# EAGLE design cpu_board (EAGLE 7.7.0)
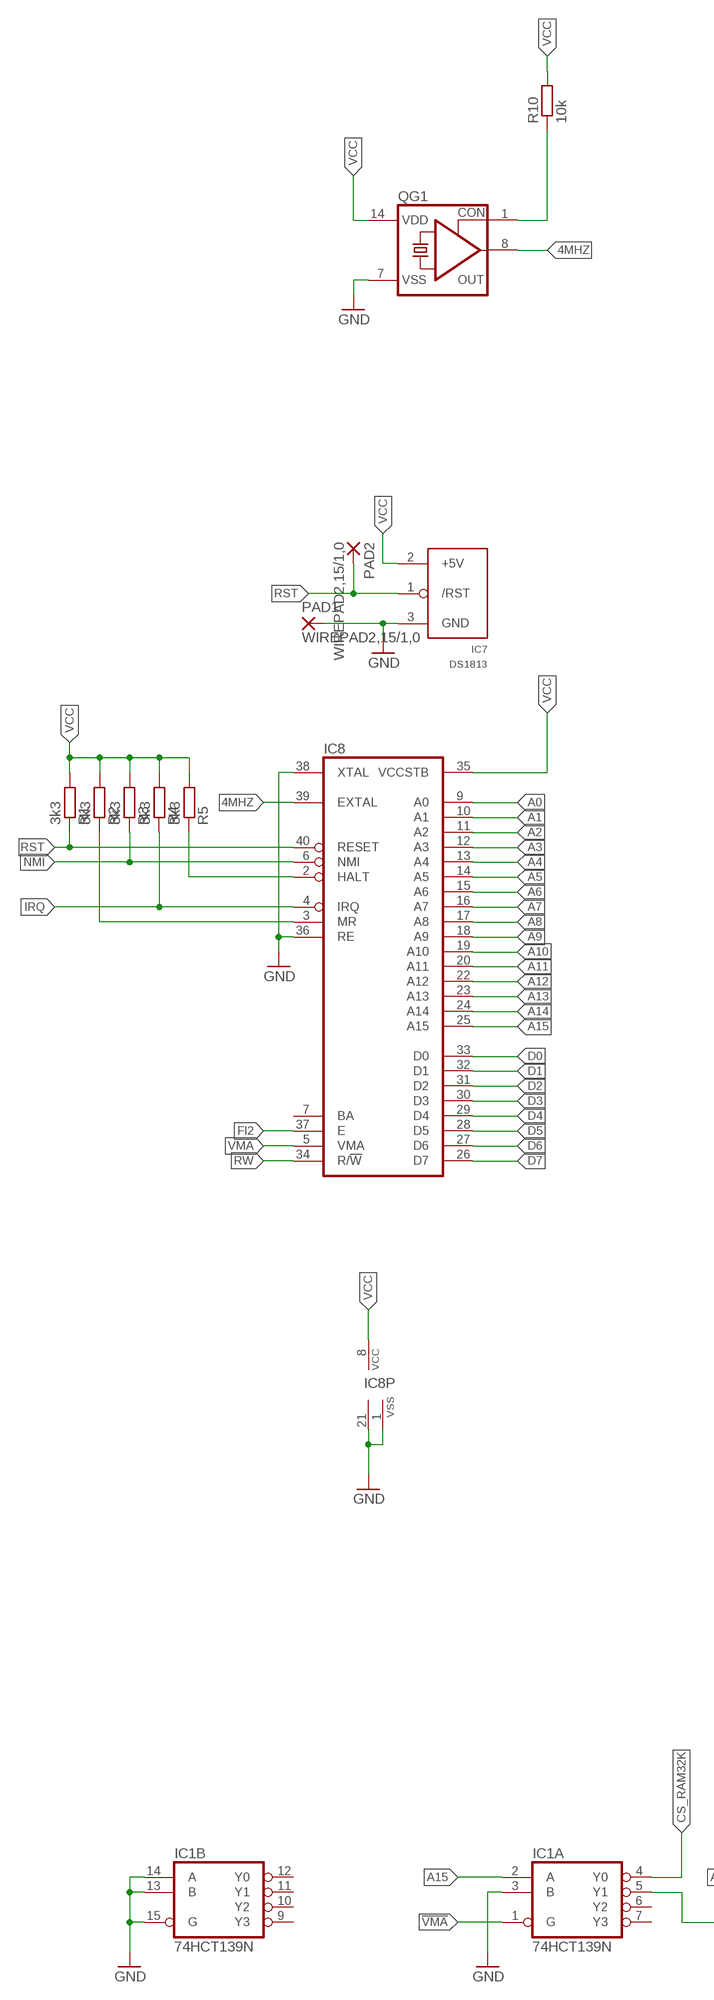
[diagram p0: schematic, sheet 1, part 1 of 2]
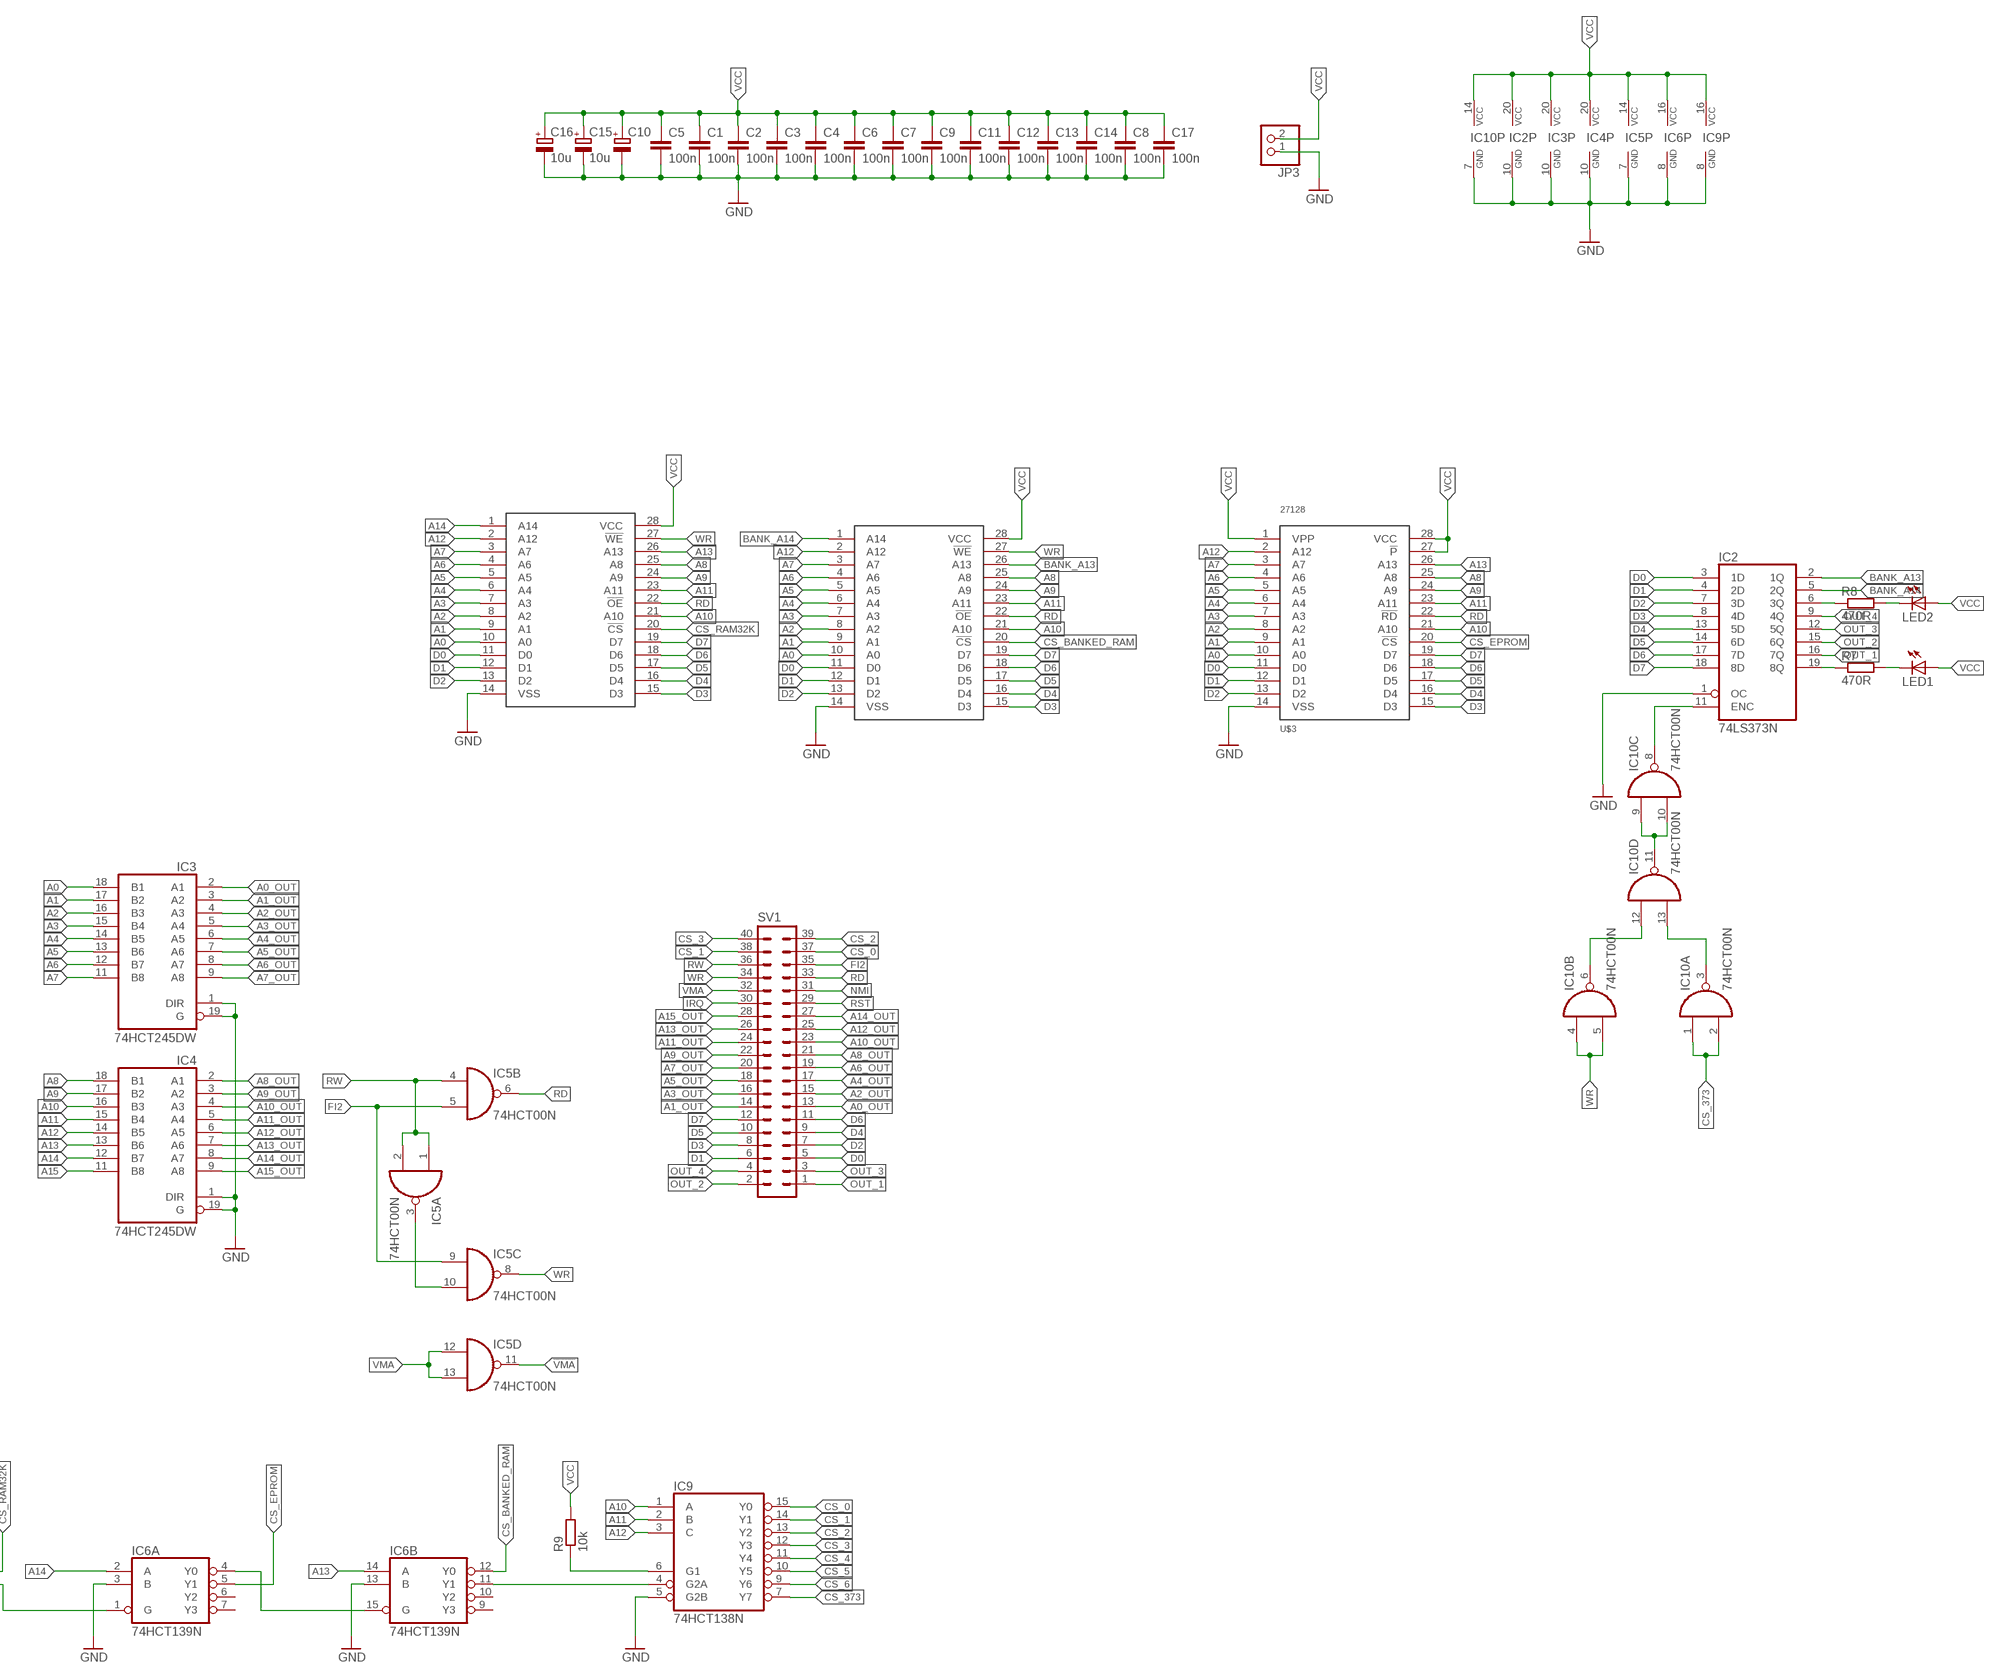
[diagram p1: schematic, sheet 1, part 2 of 2]

## Parts
C1  100n  C-EUC1206  [C1206]
C2  100n  C-EUC1206  [C1206]
C3  100n  C-EUC1206  [C1206]
C4  100n  C-EUC1206  [C1206]
C5  100n  C-EUC0603  [C0603]
C6  100n  C-EUC1206  [C1206]
C7  100n  C-EUC0603  [C0603]
C8  100n  C-EUC1206  [C1206]
C9  100n  C-EUC1206  [C1206]
C10  CPOL-EUE5-10.5  [E5-10,5]
C11  100n  C-EUC0805  [C0805]
C12  100n  C-EUC0805  [C0805]
C13  100n  C-EUC0805  [C0805]
C14  100n  C-EUC0603  [C0603]
C15  10u  CPOL-EUSMCB  [SMC_B]
C16  10u  CPOL-EUSMCB  [SMC_B]
C17  100n  C-EUC0805  [C0805]
IC1  74HCT139N  [DIL16]
IC2  74LS373N  [DIL20]
IC3  74HCT245DW  [SO20W]
IC4  74HCT245DW  [SO20W]
IC5  74HCT00N  [DIL14]
IC6  74HCT139N  [DIL16]
IC7  DS1813  [TO-92]
IC8  6802  [DIL40]
IC9  74HCT138N  [DIL16]
IC10  74HCT00N  [DIL14]
JP3  PINHD-1X2/90  [1X02/90]
LED1  LED5MM  [LED5MM]
LED2  LED5MM  [LED5MM]
PAD1  WIREPAD2,15/1,0  [2,15/1,0]
PAD2  WIREPAD2,15/1,0  [2,15/1,0]
QG1  CRYSTAL_RES-SG51  [SG51]
R1  3k3  R-EU_R1206  [R1206]
R2  3k3  R-EU_R1206  [R1206]
R3  3k3  R-EU_R1206  [R1206]
R4  3k3  R-EU_R0603  [R0603]
R5  3k3  R-EU_R1206  [R1206]
R7  470R  R-EU_R1206  [R1206]
R8  470R  R-EU_R1206  [R1206]
R9  10k  R-EU_0204/7  [0204/7]
R10  10k  R-EU_R1206  [R1206]
SV1  ML40L  [ML40L]
U$2  62256  [DIL28-6]
U$3  27128  [DIL28]
U$4  62256  [DIL28-6]

## Nets
4MHZ: IC8.39(EXTAL) QG1.8(OUT)
!VMA: IC1.1(A:G) IC5.11(D:O)
A0: IC3.18(B1) IC8.9(A0) U$2.10(A0) U$3.10(A0) U$4.10(A0)
A0_OUT: IC3.2(A1) SV1.13
A1: IC3.17(B2) IC8.10(A1) U$2.9(A1) U$3.9(A1) U$4.9(A1)
A1_OUT: IC3.3(A2) SV1.14
A2: IC3.16(B3) IC8.11(A2) U$2.8(A2) U$3.8(A2) U$4.8(A2)
A2_OUT: IC3.4(A3) SV1.15
A3: IC3.15(B4) IC8.12(A3) U$2.7(A3) U$3.7(A3) U$4.7(A3)
A3_OUT: IC3.5(A4) SV1.16
A4: IC3.14(B5) IC8.13(A4) U$2.6(A4) U$3.6(A4) U$4.6(A4)
A4_OUT: IC3.6(A5) SV1.17
A5: IC3.13(B6) IC8.14(A5) U$2.5(A5) U$3.5(A5) U$4.5(A5)
A5_OUT: IC3.7(A6) SV1.18
A6: IC3.12(B7) IC8.15(A6) U$2.4(A6) U$3.4(A6) U$4.4(A6)
A6_OUT: IC3.8(A7) SV1.19
A7: IC3.11(B8) IC8.16(A7) U$2.3(A7) U$3.3(A7) U$4.3(A7)
A7_OUT: IC3.9(A8) SV1.20
A8: IC4.18(B1) IC8.17(A8) U$2.25(A8) U$3.25(A8) U$4.25(A8)
A8_OUT: IC4.2(A1) SV1.21
A9: IC4.17(B2) IC8.18(A9) U$2.24(A9) U$3.24(A9) U$4.24(A9)
A9_OUT: IC4.3(A2) SV1.22
A10: IC4.16(B3) IC8.19(A10) IC9.1(A) U$2.21(A10) U$3.21(A10) U$4.21(A10)
A10_OUT: IC4.4(A3) SV1.23
A11: IC4.15(B4) IC8.20(A11) IC9.2(B) U$2.23(A11) U$3.23(A11) U$4.23(A11)
A11_OUT: IC4.5(A4) SV1.24
A12: IC4.14(B5) IC8.22(A12) IC9.3(C) U$2.2(A12) U$3.2(A12) U$4.2(A12)
A12_OUT: IC4.6(A5) SV1.25
A13: IC4.13(B6) IC6.14(B:A) IC8.23(A13) U$3.26(A13) U$4.26(A13)
A13_OUT: IC4.7(A6) SV1.26
A14: IC4.12(B7) IC6.2(A:A) IC8.24(A14) U$4.1(A14)
A14_OUT: IC4.8(A7) SV1.27
A15: IC1.2(A:A) IC4.11(B8) IC8.25(A15)
A15_OUT: IC4.9(A8) SV1.28
BANK_A13: IC2.2(1Q) U$2.26(A13)
BANK_A14: IC2.5(2Q) U$2.1(A14)
CS_0: IC9.15(Y0) SV1.37
CS_1: IC9.14(Y1) SV1.38
CS_2: IC9.13(Y2) SV1.39
CS_3: IC9.12(Y3) SV1.40
CS_4: IC9.11(Y4)
CS_5: IC9.10(Y5)
CS_6: IC9.9(Y6)
CS_373: IC9.7(Y7) IC10.1(A:I0) IC10.2(A:I1)
CS_BANKED_RAM: IC6.12(B:Y0) U$2.20(!CS)
CS_EPROM: IC6.5(A:Y1) U$3.20(!CS)
CS_RAM32K: IC1.4(A:Y0) U$4.20(!CS)
D0: IC2.3(1D) IC8.33(D0) SV1.5 U$2.11(D0) U$3.11(D0) U$4.11(D0)
D1: IC2.4(2D) IC8.32(D1) SV1.6 U$2.12(D1) U$3.12(D1) U$4.12(D1)
D2: IC2.7(3D) IC8.31(D2) SV1.7 U$2.13(D2) U$3.13(D2) U$4.13(D2)
D3: IC2.8(4D) IC8.30(D3) SV1.8 U$2.15(D3) U$3.15(D3) U$4.15(D3)
D4: IC2.13(5D) IC8.29(D4) SV1.9 U$2.16(D4) U$3.16(D4) U$4.16(D4)
D5: IC2.14(6D) IC8.28(D5) SV1.10 U$2.17(D5) U$3.17(D5) U$4.17(D5)
D6: IC2.17(7D) IC8.27(D6) SV1.11 U$2.18(D6) U$3.18(D6) U$4.18(D6)
D7: IC2.18(8D) IC8.26(D7) SV1.12 U$2.19(D7) U$3.19(D7) U$4.19(D7)
FI2: IC5.5(B:I1) IC5.9(C:I0) IC8.37(E) SV1.35
GND: C1.2 C2.2 C3.2 C4.2 C5.2 C6.2 C7.2 C8.2 C9.2 C10.- C11.2 C12.2 C13.2 C14.2 C15.- C16.- C17.2 IC1.3(A:B) IC1.13(B:B) IC1.14(B:A) IC1.15(B:G) IC2.1(OC) IC2.10(GND) IC3.1(DIR) IC3.10(GND) IC3.19(G) IC4.1(DIR) IC4.10(GND) IC4.19(G) IC5.7(P:GND) IC6.3(A:B) IC6.8(P:GND) IC6.13(B:B) IC7.3(GND) IC8.1(VSS) IC8.21(VSS) IC8.36(RE) IC8.38(XTAL) IC9.5(G2B) IC9.8(GND) IC10.7(P:GND) JP3.1 PAD1.1(P) QG1.7(VSS) U$2.14(VSS) U$3.14(VSS) U$4.14(VSS)
IRQ: IC8.4(IRQ) R4.1 SV1.30
N$1: IC1.5(A:Y1) IC6.1(A:G)
N$3: IC2.19(8Q) R7.1
N$4: LED1.K(C) R7.2
N$5: IC8.3(MR) R2.1
N$6: IC8.2(HALT) R5.1
N$7: QG1.1(CON) R10.1
N$11: IC2.11(ENC) IC10.8(C:O)
N$12: IC10.9(C:I0) IC10.10(C:I1) IC10.11(D:O)
N$13: IC10.3(A:O) IC10.13(D:I1)
N$14: IC10.6(B:O) IC10.12(D:I0)
N$15: IC2.6(3Q) R8.1
N$17: LED2.K(C) R8.2
N$18: IC5.3(A:O) IC5.10(C:I1)
N$19: IC6.4(A:Y0) IC6.15(B:G)
N$20: IC9.6(G1) R9.1
N$21: IC6.11(B:Y1) IC9.4(G2A)
NMI: IC8.6(NMI) R3.1 SV1.31
OUT_1: IC2.16(7Q) SV1.1
OUT_2: IC2.15(6Q) SV1.2
OUT_3: IC2.12(5Q) SV1.3
OUT_4: IC2.9(4Q) SV1.4
RD: IC5.6(B:O) SV1.33 U$2.22(!OE) U$3.22(!RD) U$4.22(!OE)
RST: IC7.1(/RST) IC8.40(RESET) PAD2.1(P) R1.1 SV1.29
RW: IC5.1(A:I0) IC5.2(A:I1) IC5.4(B:I0) IC8.34(R/!W) SV1.36
VCC: C1.1 C2.1 C3.1 C4.1 C5.1 C6.1 C7.1 C8.1 C9.1 C10.+ C11.1 C12.1 C13.1 C14.1 C15.+ C16.+ C17.1 IC2.20(VCC) IC3.20(VCC) IC4.20(VCC) IC5.14(P:VCC) IC6.16(P:VCC) IC7.2(+5V) IC8.8(VCC) IC8.35(VCCSTB) IC9.16(VCC) IC10.14(P:VCC) JP3.2 LED1.A LED2.A QG1.14(VDD) R1.2 R2.2 R3.2 R4.2 R5.2 R9.2 R10.2 U$2.28(VCC) U$3.1(VPP) U$3.27(!P) U$3.28(VCC) U$4.28(VCC)
VMA: IC5.12(D:I0) IC5.13(D:I1) IC8.5(VMA) SV1.32
WR: IC5.8(C:O) IC10.4(B:I0) IC10.5(B:I1) SV1.34 U$2.27(!WE) U$4.27(!WE)
Unconnected: IC1.6(A:Y2) IC1.7(A:Y3) IC1.9(B:Y3) IC1.10(B:Y2) IC1.11(B:Y1) IC1.12(B:Y0) IC6.6(A:Y2) IC6.7(A:Y3) IC6.9(B:Y3) IC6.10(B:Y2) IC8.7(BA)

## Power pins joined to a net without a drawn wire
GND: IC1.8(P:GND)
VCC: IC1.16(P:VCC)

## Library data of the parts
C1-C9 C11-C14 C17 = rcl:C-EU: CAPACITOR, European symbol
C10 C15 C16 = rcl:CPOL-EU: POLARIZED CAPACITOR, European symbol
IC1 IC6 = 74xx-eu:74*139: Dual 2-line to 4-line DECODER/DEMULTIPLEXER
IC2 = 74xx-eu:74*373: Octal D type transparent LATCH, edge triggered
IC3 IC4 = 74xx-eu:74*245: Octal BUS TRANSCEIVER, 3-state
IC5 IC10 = 74xx-eu:74*00: Quad 2-input NAND gate
IC7 = ds1813_revised:DS1813
IC8 = micro-motorola:6802: MICROCONTROLLER/MEMORY DEVICE; OC_FARNELL: unknown; OC_NEWARK: unknown
IC9 = 74xx-eu:74*138: 3-line to 8-line DECODER/DEMULTIPLEXER
JP3 = pinhead:PINHD-1X2: PIN HEADER
LED1 LED2 = led:LED: LED OSRAM: - CHIPLED LG R971, LG N971, LY N971, LG Q971, LY Q971, LO R971, LY R971 LH N974, LH R974 LS Q976, LO Q976, LY Q976 LO Q996 - Hyper CHIPLED LW Q18S LB Q993, LB Q99A, LB R99A - SideLED LS A670, LO A670, LY A670, LG A670, LP A670 LB A673, LV A673, LT A673, LW A673 LH A674 LY A675 LS A676, LA A676, LO A676, LY A676, LW A676 LS A679, LY A679, LG A679 - Hyper Micro SIDELED® LS Y876, LA Y876, LO Y876, LY Y876 LT Y87S - SmartLED LW L88C, LW L88S LB L89C, LB L89S, LG L890 LS L89K, LO L89K, LY L89K LS L896, LA L896, LO L896, LY L896 - TOPLED LS T670, LO T670, LY T670, LG T670, LP T670 LSG T670, LSP T670, LSY T670, LOP T670, LYG T670 LG T671, LOG T671, LSG T671 LB T673, LV T673, LT T673, LW T673 LH T674 LS T676, LA T676, LO T676, LY T676, LB T676, LH T676, LSB T676, LW T676 LB T67C, LV T67C, LT T67C, LS T67K, LO T67K, LY T67K, LW E67C LS E67B, LA E67B, LO E67B, LY E67B, LB E67C, LV E67C, LT E67C LW T67C LS T679, LY T679, LG T679 LS T770, LO T770, LY T770, LG T770, LP T770 LB T773, LV T773, LT T773, LW T773 LH T774 LS E675, LA E675, LY E675, LS T675 LS T776, LA T776, LO T776, LY T776, LB T776 LHGB T686 LT T68C, LB T68C - Hyper Mini TOPLED® LB M676 - Mini TOPLED Santana® LG M470 LS M47K, LO M47K, LY M47K Source: http://www.osram.convergy.de LUXEON: - LUMILED® LXK2-PW12-R00, LXK2-PW12-S00, LXK2-PW14-U00, LXK2-PW14-V00 LXK2-PM12-R00, LXK2-PM12-S00, LXK2-PM14-U00 LXK2-PE12-Q00, LXK2-PE12-R00, LXK2-PE12-S00, LXK2-PE14-T00, LXK2-PE14-U00 LXK2-PB12-K00, LXK2-PB12-L00, LXK2-PB12-M00, LXK2-PB14-N00, LXK2-PB14-P00, LXK2-PB14-Q00 LXK2-PR12-L00, LXK2-PR12-M00, LXK2-PR14-Q00, LXK2-PR14-R00 LXK2-PD12-Q00, LXK2-PD12-R00, LXK2-PD12-S00 LXK2-PH12-R00, LXK2-PH12-S00 LXK2-PL12-P00, LXK2-PL12-Q00, LXK2-PL12-R00 Source: www.luxeon.com KINGBRIGHT: KA-3528ASYC Source: www.kingbright.com
PAD1 PAD2 = wirepad:WIREPAD: Wire PAD connect wire on PCB
QG1 = crystal:CRYSTAL_RES-: CRYSTAL RESONATOR; OC_FARNELL: unknown; OC_NEWARK: unknown
R1-R5 R7-R10 = rcl:R-EU_: RESISTOR, European symbol
SV1 = con-harting-ml:ML40: HARTING; OC_FARNELL: unknown; OC_NEWARK: unknown
U$2 U$4 = memory-sram:62256
U$3 = mw:27128

## Board
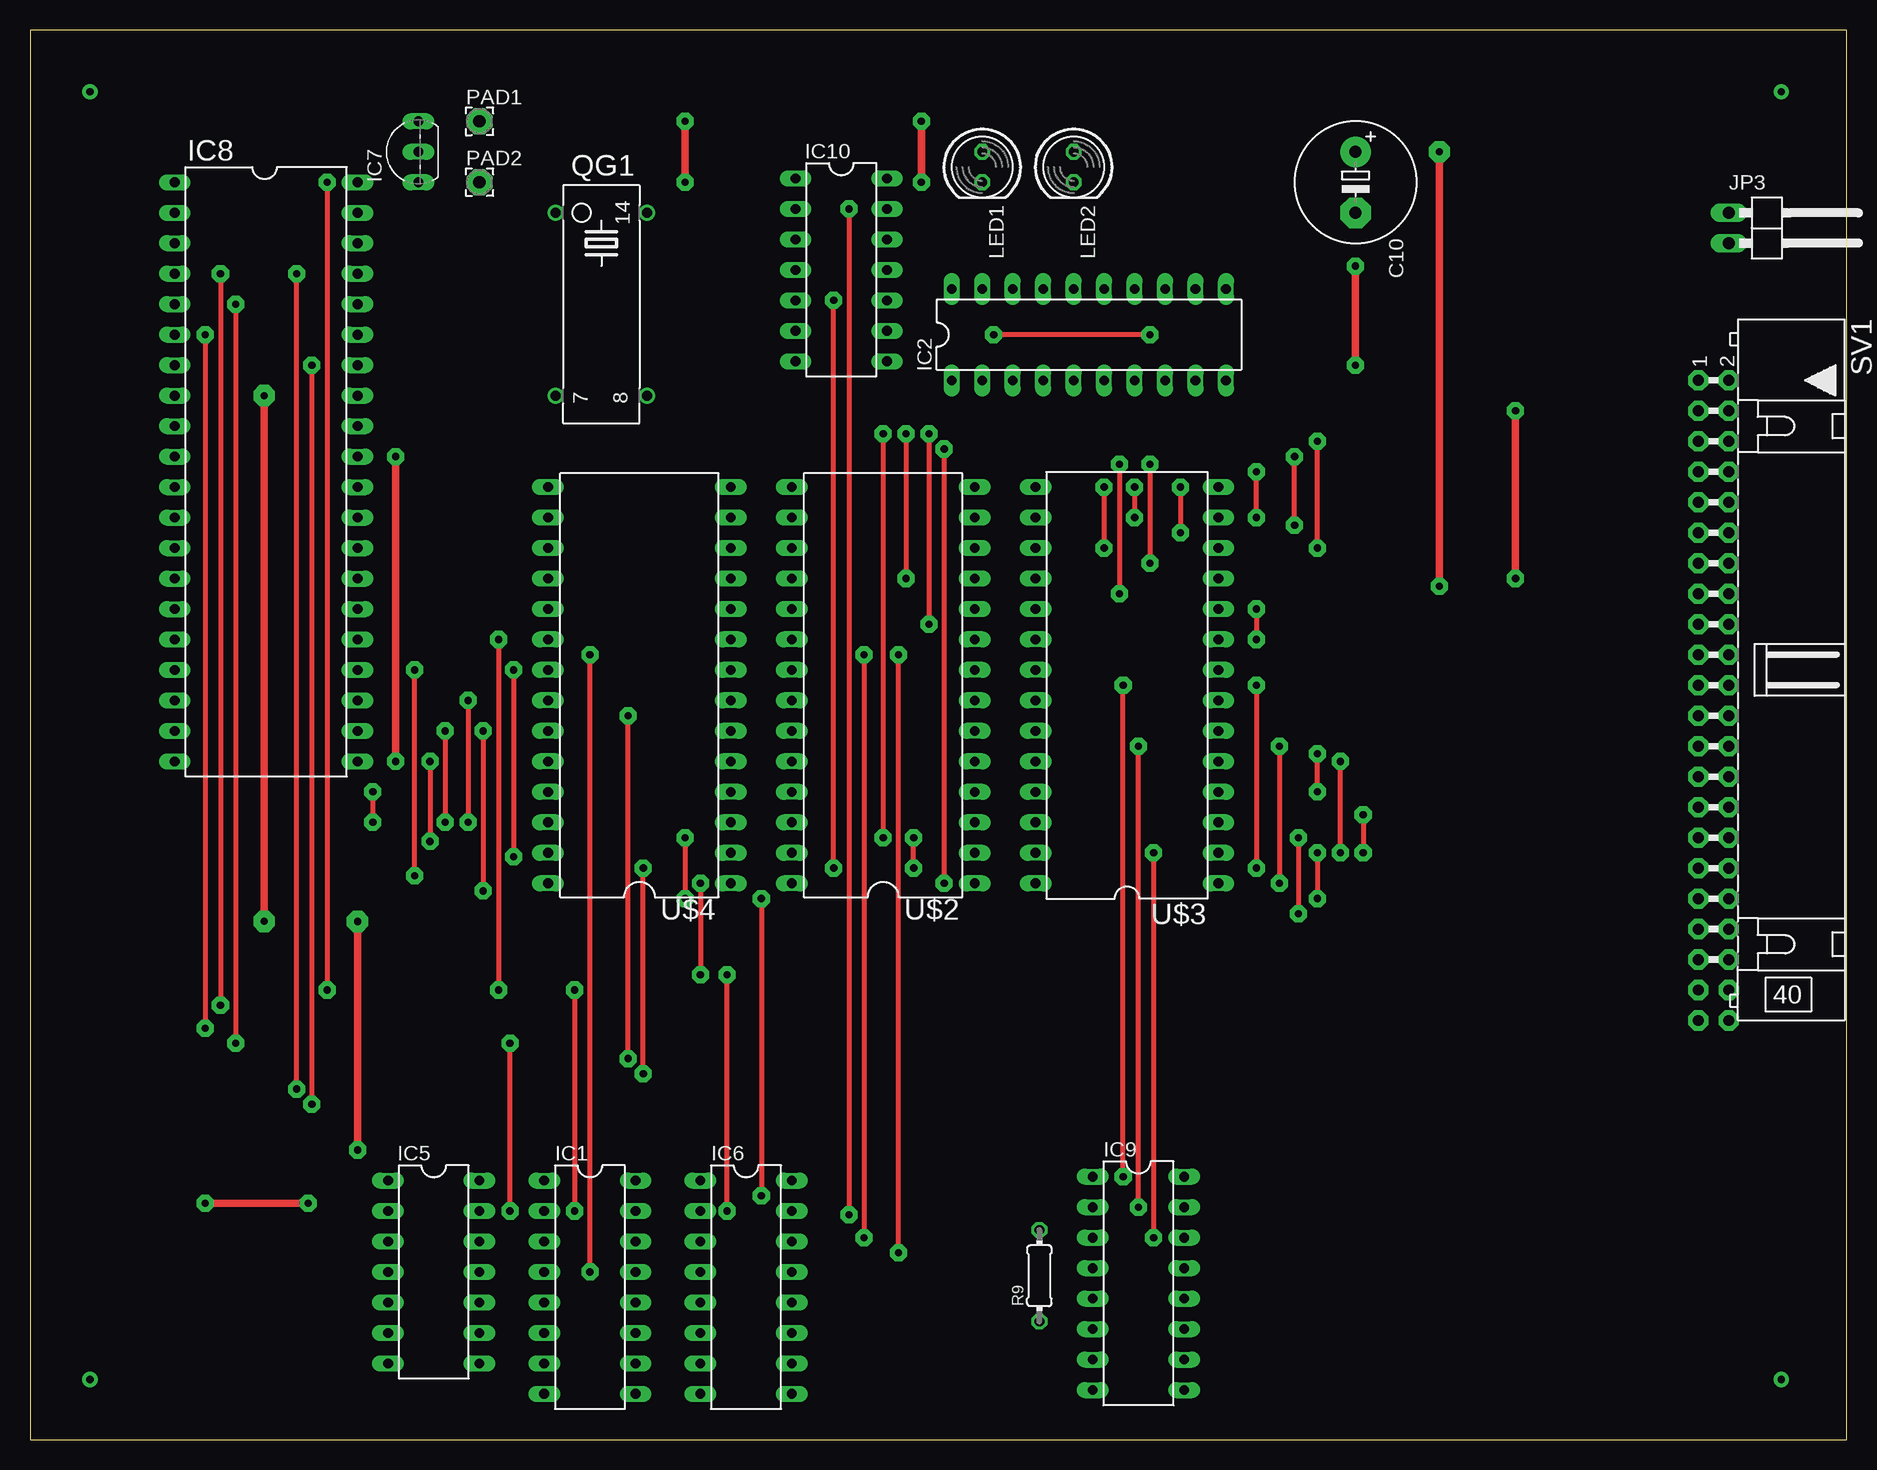
[diagram p2: board, top side]
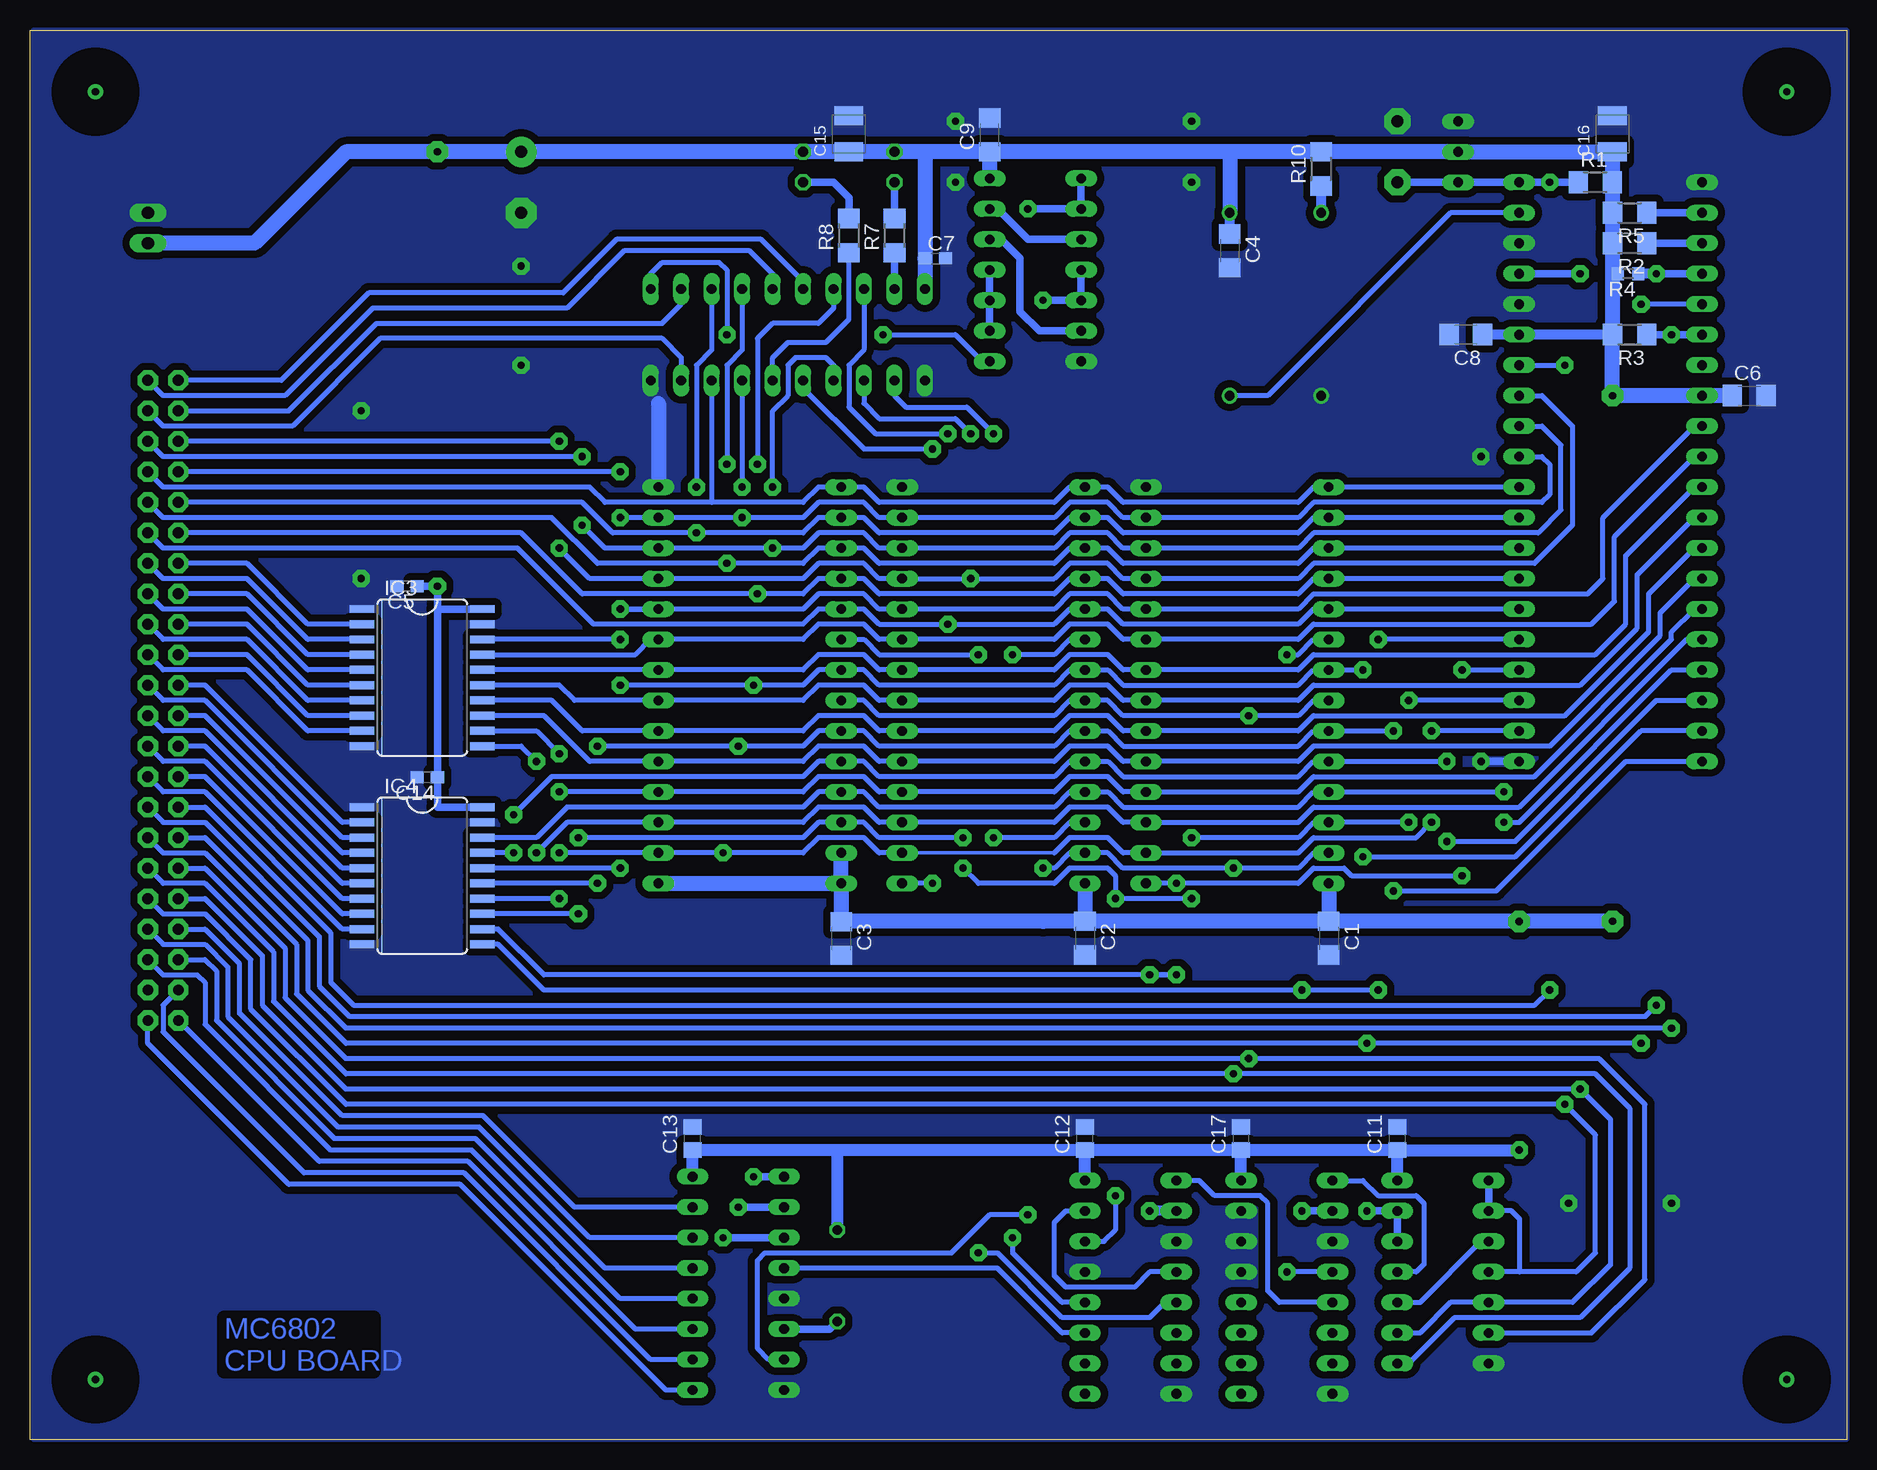
[diagram p3: board, bottom side, seen from below]

Size 151.44 x 117.47 mm. Coordinates in mm from the lower left corner, seen from the top.
Outline: 0,0 151.44,0 151.44,117.47 0,117.47 0,0
Copper layers (1*16): Top 0.035mm / dielectric 1.5mm / Bottom 0.035mm
Design rules "default *": minimum track width 10mil, minimum drill 24mil, track to track 8mil, track to pad 8mil, pad to pad 8mil, via to via 8mil, smd to smd 8mil, copper to edge 0mil, drill to drill 8mil, minimum pad ring 10mil, minimum via ring 8mil, stop-mask expansion 4mil, vias tented up to drill 0mil, thermal gap 10mil
bRestrict: area 2,2 to 8,8; area 2,109.3 to 8,115.4; area 142.9,2 to 149,8; area 142.9,109.3 to 149,115.4

### Footprints (pad centres in the part's own frame; a part is rotated, then mirrored left to right if it is on the bottom)
C1206 = smd 1.6 x 1.8: 1 -1.4,0; 2 1.4,0
C0603 = smd 1.1 x 1: 1 -0.85,0; 2 0.85,0
E5-10,5 = drill 1.016 pad 2.54: + -2.54,0 | drill 1.016 pad 2.54 octagon: - 2.54,0
C0805 = smd 1.3 x 1.5: 1 -0.95,0; 2 0.95,0
SMC_B = smd 1.6 x 2.4: + -1.5,0; - 1.5,0
DIL16 = drill 0.813 long: 1 -8.89,-3.81; 2 -6.35,-3.81; 3 -3.81,-3.81; 4 -1.27,-3.81; 5 1.27,-3.81; 6 3.81,-3.81; 7 6.35,-3.81; 8 8.89,-3.81; 9 8.89,3.81; 10 6.35,3.81; 11 3.81,3.81; 12 1.27,3.81; 13 -1.27,3.81; 14 -3.81,3.81; 15 -6.35,3.81; 16 -8.89,3.81
DIL20 = drill 0.813 long: 1 -11.43,-3.81; 2 -8.89,-3.81; 3 -6.35,-3.81; 4 -3.81,-3.81; 5 -1.27,-3.81; 6 1.27,-3.81; 7 3.81,-3.81; 8 6.35,-3.81; 9 8.89,-3.81; 10 11.43,-3.81; 11 11.43,3.81; 12 8.89,3.81; 13 6.35,3.81; 14 3.81,3.81; 15 1.27,3.81; 16 -1.27,3.81; 17 -3.81,3.81; 18 -6.35,3.81; 19 -8.89,3.81; 20 -11.43,3.81
SO20W = smd 0.66 x 2.032: 1 -5.715,-5.029; 2 -4.445,-5.029; 3 -3.175,-5.029; 4 -1.905,-5.029; 5 -0.635,-5.029; 6 0.635,-5.029; 7 1.905,-5.029; 8 3.175,-5.029; 9 4.445,-5.029; 10 5.715,-5.029; 11 5.715,5.029; 12 4.445,5.029; 13 3.175,5.029; 14 1.905,5.029; 15 0.635,5.029; 16 -0.635,5.029; 17 -1.905,5.029; 18 -3.175,5.029; 19 -4.445,5.029; 20 -5.715,5.029
DIL14 = drill 0.813 long: 1 -7.62,-3.81; 2 -5.08,-3.81; 3 -2.54,-3.81; 4 0,-3.81; 5 2.54,-3.81; 6 5.08,-3.81; 7 7.62,-3.81; 8 7.62,3.81; 9 5.08,3.81; 10 2.54,3.81; 11 0,3.81; 12 -2.54,3.81; 13 -5.08,3.81; 14 -7.62,3.81
TO-92 = drill 0.813 long: 1 -2.54,0; 2 0,0; 3 2.54,0
DIL40 = drill 0.813 long: 1 -24.13,-7.62; 2 -21.59,-7.62; 3 -19.05,-7.62; 4 -16.51,-7.62; 5 -13.97,-7.62; 6 -11.43,-7.62; 7 -8.89,-7.62; 8 -6.35,-7.62; 9 -3.81,-7.62; 10 -1.27,-7.62; 11 1.27,-7.62; 12 3.81,-7.62; 13 6.35,-7.62; 14 8.89,-7.62; 15 11.43,-7.62; 16 13.97,-7.62; 17 16.51,-7.62; 18 19.05,-7.62; 19 21.59,-7.62; 20 24.13,-7.62; 21 24.13,7.62; 22 21.59,7.62; 23 19.05,7.62; 24 16.51,7.62; 25 13.97,7.62; 26 11.43,7.62; 27 8.89,7.62; 28 6.35,7.62; 29 3.81,7.62; 30 1.27,7.62; 31 -1.27,7.62; 32 -3.81,7.62; 33 -6.35,7.62; 34 -8.89,7.62; 35 -11.43,7.62; 36 -13.97,7.62; 37 -16.51,7.62; 38 -19.05,7.62; 39 -21.59,7.62; 40 -24.13,7.62
1X02/90 = drill 1.016 long: 1 -1.27,-3.81; 2 1.27,-3.81
LED5MM = drill 0.813 octagon: A -1.27,0; K 1.27,0
2,15/1,0 = drill 1.016 pad 2.159 octagon: 1 0,0
SG51 = drill 0.813: 1 -7.62,-3.81; 7 7.62,-3.81; 8 7.62,3.81; 14 -7.62,3.81
R1206 = smd 1.6 x 1.803: 1 -1.422,0; 2 1.422,0
R0603 = smd 1 x 1.1: 1 -0.85,0; 2 0.85,0
0204/7 = drill 0.813 octagon: 1 -3.81,0; 2 3.81,0
ML40L = drill 0.914 pad 1.676 octagon: 1 -24.13,-1.27; 2 -24.13,1.27; 3 -21.59,-1.27; 4 -21.59,1.27; 5 -19.05,-1.27; 6 -19.05,1.27; 7 -16.51,-1.27; 8 -16.51,1.27; 9 -13.97,-1.27; 10 -13.97,1.27; 11 -11.43,-1.27; 12 -11.43,1.27; 13 -8.89,-1.27; 14 -8.89,1.27; 15 -6.35,-1.27; 16 -6.35,1.27; 17 -3.81,-1.27; 18 -3.81,1.27; 19 -1.27,-1.27; 20 -1.27,1.27; 21 1.27,-1.27; 22 1.27,1.27; 23 3.81,-1.27; 24 3.81,1.27; 25 6.35,-1.27; 26 6.35,1.27; 27 8.89,-1.27; 28 8.89,1.27; 29 11.43,-1.27; 30 11.43,1.27; 31 13.97,-1.27; 32 13.97,1.27; 33 16.51,-1.27; 34 16.51,1.27; 35 19.05,-1.27; 36 19.05,1.27; 37 21.59,-1.27; 38 21.59,1.27; 39 24.13,-1.27; 40 24.13,1.27
DIL28-6 = drill 0.813 long: 1 -16.51,-7.62; 2 -13.97,-7.62; 3 -11.43,-7.62; 4 -8.89,-7.62; 5 -6.35,-7.62; 6 -3.81,-7.62; 7 -1.27,-7.62; 8 1.27,-7.62; 9 3.81,-7.62; 10 6.35,-7.62; 11 8.89,-7.62; 12 11.43,-7.62; 13 13.97,-7.62; 14 16.51,-7.62; 15 16.51,7.62; 16 13.97,7.62; 17 11.43,7.62; 18 8.89,7.62; 19 6.35,7.62; 20 3.81,7.62; 21 1.27,7.62; 22 -1.27,7.62; 23 -3.81,7.62; 24 -6.35,7.62; 25 -8.89,7.62; 26 -11.43,7.62; 27 -13.97,7.62; 28 -16.51,7.62
DIL28 = drill 0.813 long: 1 -16.51,-7.62; 2 -13.97,-7.62; 3 -11.43,-7.62; 4 -8.89,-7.62; 5 -6.35,-7.62; 6 -3.81,-7.62; 7 -1.27,-7.62; 8 1.27,-7.62; 9 3.81,-7.62; 10 6.35,-7.62; 11 8.89,-7.62; 12 11.43,-7.62; 13 13.97,-7.62; 14 16.51,-7.62; 15 16.51,7.62; 16 13.97,7.62; 17 11.43,7.62; 18 8.89,7.62; 19 6.35,7.62; 20 3.81,7.62; 21 1.27,7.62; 22 -1.27,7.62; 23 -3.81,7.62; 24 -6.35,7.62; 25 -8.89,7.62; 26 -11.43,7.62; 27 -13.97,7.62; 28 -16.51,7.62

### Placement (x,y rotation side)
C1  43.18,41.78 270 bottom
C2  63.5,41.78 270 bottom
C3  83.82,41.76 270 bottom
C4  51.44,99.06 270 bottom
C5  120,71.12 180 bottom
C6  8.13,87 0 bottom
C7  75.98,98.42 0 bottom
C8  31.75,92.08 180 bottom
C9  71.44,108.72 90 bottom
C10  110.49,104.78 270 top
C11  37.47,25.08 90 bottom
C12  63.5,25.08 90 bottom
C13  96.2,25.08 90 bottom
C14  118.33,55.18 180 bottom
C15  83.19,108.81 90 bottom
C16  19.53,108.81 90 bottom
C17  50.48,25.08 90 bottom
IC1  46.67,12.7 270 top
IC2  88.27,92.08 0 top
IC3  118.75,63.5 270 bottom
IC4  118.75,46.99 270 bottom
IC5  33.66,13.97 270 top
IC6  59.69,12.7 270 top
IC7  32.38,107.31 90 top
IC8  19.68,80.64 270 top
IC9  92.39,13.02 270 top
IC10  67.63,97.47 270 top
JP3  145.41,100.97 270 top
LED1  79.38,106.05 270 top
LED2  87,106.05 270 top
PAD1  37.47,109.86 0 top
PAD2  37.47,104.78 0 top
QG1  47.62,94.61 270 top
R1  20.95,104.78 0 bottom
R2  18.1,99.69 180 bottom
R3  18.1,92.08 180 bottom
R4  18.22,97.16 180 bottom
R5  18.1,102.23 180 bottom
R7  79.38,100.33 90 bottom
R8  83.19,100.33 90 bottom
R9  84.14,13.65 90 top
R10  43.81,105.89 90 bottom
SV1  140.34,64.14 270 top
U$2  71.12,62.87 90 top
U$3  91.44,62.87 90 top
U$4  50.8,62.87 90 top

### Tracks (layer width: path | path; a pad name or v marks a point on that pad's centre or on a via)
4MHZ
  Bottom 0.406: IC8.39 33.02,102.23 48.26,87 QG1.8
!VMA
  Bottom 0.406: IC1.1 40.32,21.59 39.05,20.32 35.88,20.32 35.24,19.68 35.24,14.61 35.88,13.97 IC5.11
A0  (via drill 0.6 pad 1.42)
  Top 0.406: v102.23,69.22 v102.23,66.67
  Bottom 0.406: IC8.9 12.7,84.45 20.32,76.83 20.32,71.75 21.59,70.48 44.45,70.48 45.72,69.22 U$4.10 60.33,69.22 61.59,70.48 64.77,70.48 66.04,69.22 U$2.10 80.64,69.22 81.92,70.48 85.72,70.48 87,69.22 v102.23,69.22 U$3.10 | v102.23,66.67 IC3.18
A0_OUT
  Bottom 0.406: IC3.2 128.27,67.94 133.35,73.03 SV1.13
A1
  Bottom 0.406: IC8.10 12.7,81.92 19.37,75.25 19.37,69.85 21.27,67.94 44.45,67.94 45.72,66.67 U$4.9 60.33,66.67 61.59,67.94 64.77,67.94 66.04,66.67 U$2.9 80.64,66.67 81.92,67.94 85.72,67.94 87,66.67 U$3.9 99.69,66.67 100.97,65.41 IC3.17
A1_OUT
  Bottom 0.406: IC3.3 128.27,66.67 133.35,71.75 140.34,71.75 SV1.14
A2
  Bottom 0.406: IC8.11 12.7,79.38 18.41,73.66 18.41,67.94 20.95,65.41 44.45,65.41 45.72,64.14 U$4.8 60.33,64.14 61.59,65.41 64.77,65.41 66.04,64.14 U$2.8 80.64,64.14 81.92,65.41 85.72,65.41 87,64.14 U$3.8 IC3.16
A2_OUT
  Bottom 0.406: IC3.4 128.27,65.41 133.35,70.48 SV1.15
A3
  Bottom 0.406: IC8.12 12.7,76.83 17.46,72.07 17.46,67.63 22.23,62.87 44.45,62.87 45.72,61.59 U$4.7 60.33,61.59 61.59,62.87 64.77,62.87 66.04,61.59 U$2.7 80.64,61.59 81.92,62.87 85.72,62.87 87,61.59 U$3.7 106.05,61.59 107.31,62.87 IC3.15
A3_OUT
  Bottom 0.406: IC3.5 128.27,64.14 133.35,69.22 140.34,69.22 SV1.16
A4
  Bottom 0.406: IC8.13 12.7,74.3 16.51,70.48 16.51,67.31 23.5,60.33 44.45,60.33 45.72,59.05 U$4.6 60.33,59.05 61.59,60.33 64.77,60.33 66.04,59.05 U$2.6 80.64,59.05 81.92,60.33 85.72,60.33 87,59.05 U$3.6 105.41,59.05 107.95,61.59 IC3.14
A4_OUT
  Bottom 0.406: IC3.6 128.27,62.87 133.35,67.94 SV1.17
A5
  Bottom 0.406: IC8.14 12.7,71.75 15.56,68.9 15.56,66.99 24.77,57.78 44.45,57.78 45.72,56.52 U$4.5 60.33,56.52 61.59,57.78 64.77,57.78 66.04,56.52 U$2.5 80.64,56.52 81.92,57.78 85.72,57.78 87,56.52 U$3.5 104.78,56.52 108.58,60.33 IC3.13
A5_OUT
  Bottom 0.406: IC3.7 128.27,61.59 133.35,66.67 140.34,66.67 SV1.18
A6  (via drill 0.6 pad 1.42)
  Top 0.406: v107.31,53.98 v107.31,57.15
  Bottom 0.406: v107.31,53.98 U$3.4 87,53.98 85.72,55.24 81.92,55.24 80.64,53.98 U$2.4 66.04,53.98 64.77,55.24 61.59,55.24 60.33,53.98 U$4.4 45.72,53.98 44.45,55.24 26.04,55.24 14.61,66.67 14.61,67.31 12.7,69.22 IC8.15 | IC3.12 109.22,59.05 v107.31,57.15
A6_OUT
  Bottom 0.406: IC3.8 128.27,60.33 133.35,65.41 SV1.19
A7  (via drill 0.6 pad 1.42)
  Top 0.406: v109.22,48.9 v109.22,56.52
  Bottom 0.406: IC8.16 13.34,66.67 27.3,52.7 44.45,52.7 45.72,51.44 U$4.3 60.33,51.44 61.59,52.7 64.77,52.7 66.04,51.44 U$2.3 80.64,51.44 81.92,52.7 85.72,52.7 87,51.44 U$3.3 106.68,51.44 v109.22,48.9 | IC3.11 110.49,57.78 v109.22,56.52
A7_OUT
  Bottom 0.406: IC3.9 128.27,59.05 133.35,64.14 140.34,64.14 SV1.20
A8  (via drill 0.6 pad 1.42)
  Top 0.406: v28.57,53.98 v28.57,51.44
  Bottom 0.406: v28.57,53.98 U$4.25 44.45,53.98 45.72,52.7 60.33,52.7 61.59,53.98 U$2.25 64.77,53.98 66.04,52.7 80.64,52.7 81.92,53.98 U$3.25 85.72,53.98 87,52.7 106.68,52.7 109.22,50.16 IC4.18 | IC8.17 14.61,64.14 27.3,51.44 v28.57,51.44
A8_OUT
  Bottom 0.406: IC4.2 125.41,51.44 136.84,62.87 SV1.21
A9  (via drill 0.6 pad 1.42)
  Top 0.406: v33.34,56.52 v33.34,49.85 | v111.12,52.07 v111.12,48.9
  Bottom 0.406: v33.34,56.52 U$4.24 44.45,56.52 45.72,55.24 60.33,55.24 61.59,56.52 U$2.24 64.77,56.52 66.04,55.24 80.64,55.24 81.92,56.52 U$3.24 85.72,56.52 87,55.24 107.95,55.24 v111.12,52.07 | IC8.18 15.88,61.59 27.62,49.85 v33.34,49.85 | v111.12,48.9 IC4.17
A9_OUT
  Bottom 0.406: IC4.3 125.41,50.16 136.84,61.59 140.34,61.59 SV1.22
A10  (via drill 0.6 pad 1.42)
  Top 0.406: v40.32,64.14 v40.32,48.58 | v102.23,62.87 v102.23,47.62 | v91.12,21.91 v91.12,62.87
  Bottom 0.406: v40.32,64.14 U$4.21 44.45,64.14 45.72,62.87 60.33,62.87 61.59,64.14 U$2.21 64.77,64.14 66.04,62.87 80.64,62.87 81.92,64.14 U$3.21 85.72,64.14 87,62.87 v91.12,62.87 v102.23,62.87 | v40.32,48.58 27.62,48.58 17.14,59.05 IC8.19 | v102.23,47.62 IC4.16
  Bottom 0.61: IC9.1 v91.12,21.91
A10_OUT
  Bottom 0.406: IC4.4 125.41,48.9 136.84,60.33 SV1.23
A11  (via drill 0.6 pad 1.42)
  Top 0.406: v37.78,59.05 v37.78,45.72 | v104.14,57.78 v104.14,46.35 | v92.39,19.37 v92.39,57.78
  Bottom 0.406: v37.78,59.05 U$4.23 44.45,59.05 45.72,57.78 60.33,57.78 61.59,59.05 U$2.23 64.77,59.05 66.04,57.78 80.64,57.78 81.92,59.05 U$3.23 85.72,59.05 87,57.78 v92.39,57.78 v104.14,57.78 | v37.78,45.72 29.21,45.72 18.41,56.52 IC8.20 | v104.14,46.35 IC4.15
  Bottom 0.61: IC9.2 v92.39,19.37
A11_OUT
  Bottom 0.406: IC4.5 125.41,47.62 136.84,59.05 140.34,59.05 SV1.24
A12  (via drill 0.6 pad 1.42)
  Top 0.406: v34.61,59.05 v34.61,51.44 | v107.31,48.9 v107.31,45.09 | v93.66,48.9 v93.66,16.83
  Bottom 0.305: 66.04,48.9 U$2.2
  Bottom 0.406: U$2.2 80.64,48.9 81.92,50.16 85.72,50.16 87,48.9 v93.66,48.9 U$3.2 v107.31,48.9 | 66.04,48.9 64.77,50.16 61.59,50.16 60.33,48.9 U$4.2 45.72,48.9 44.45,50.16 35.88,50.16 v34.61,51.44 | IC8.22 v34.61,59.05 | v107.31,45.09 IC4.14
  Bottom 0.61: IC9.3 v93.66,16.83
A12_OUT
  Bottom 0.406: IC4.6 125.41,46.35 136.84,57.78 SV1.25
A13  (via drill 0.6 pad 1.42)
  Top 0.406: v73.66,47.62 v73.66,50.16 | v36.51,61.59 v36.51,51.44 | v54.61,50.16 v54.61,45.09 | v105.73,50.16 v105.73,43.81 | v60.96,45.09 v60.96,20.32
  Bottom 0.406: v73.66,50.16 80.64,50.16 81.92,51.44 U$3.26 85.72,51.44 87,50.16 v105.73,50.16 | v54.61,45.09 v60.96,45.09 60.96,46.99 61.59,47.62 64.77,47.62 66.04,46.35 72.39,46.35 v73.66,47.62 | v36.51,51.44 U$4.26 44.45,51.44 45.72,50.16 v54.61,50.16 | IC8.23 v36.51,61.59 | v105.73,43.81 IC4.13 | v60.96,20.32 60.96,17.46 61.91,16.51 IC6.14
A13_OUT
  Bottom 0.406: IC4.7 125.41,45.09 136.84,56.52 140.34,56.52 SV1.26
A14  (via drill 0.6 pad 1.42)
  Top 0.406: v32.07,46.99 v32.07,64.14 | v55.88,46.35 v55.88,38.73 | v58.1,19.05 v58.1,38.73
  Bottom 0.406: v32.07,64.14 IC8.24 | v32.07,46.99 41.27,46.99 41.91,47.62 44.45,47.62 45.72,46.35 v55.88,46.35 U$4.1 | IC4.12 112.39,42.55 108.58,38.73 v55.88,38.73 v58.1,38.73
  Bottom 0.813: IC6.2 v58.1,19.05
A14_OUT
  Bottom 0.406: IC4.8 125.41,43.81 136.84,55.24 SV1.27
A15  (via drill 0.6 pad 1.42)
  Top 0.406: v39.05,66.67 v39.05,37.47 | v45.4,37.47 v45.4,19.05
  Bottom 0.406: IC4.11 112.39,41.27 108.58,37.47 v39.05,37.47 v45.4,37.47 | IC8.25 v39.05,66.67
  Bottom 0.61: IC1.2 v45.4,19.05
A15_OUT
  Bottom 0.406: IC4.9 125.41,42.55 136.84,53.98 140.34,53.98 SV1.28
BANK_A13  (via drill 0.6 pad 1.42)
  Top 0.406: v71.12,83.82 v71.12,50.16
  Bottom 0.406: U$2.26 64.77,51.44 66.04,50.16 v71.12,50.16 | IC2.2 79.38,87 78.42,86.04 73.34,86.04 v71.12,83.82
BANK_A14  (via drill 0.6 pad 1.42)
  Top 0.406: v76.2,82.55 v76.2,46.35
  Bottom 0.406: IC2.5 87,87.63 81.92,82.55 v76.2,82.55 | v76.2,46.35 U$2.1
CS_0
  Bottom 0.406: SV1.37 136.84,42.55 133.99,39.69 133.99,35.56 125.41,26.99 113.67,26.99 106.05,19.37 IC9.15
CS_1
  Bottom 0.406: SV1.38 140.34,41.27 136.84,41.27 134.94,39.37 134.94,35.24 125.73,26.04 113.98,26.04 104.78,16.83 IC9.14
CS_2
  Bottom 0.406: SV1.39 136.84,40.01 135.89,39.05 135.89,34.92 126.05,25.08 114.3,25.08 103.5,14.29 IC9.13
CS_3
  Bottom 0.406: SV1.40 140.34,38.73 137.48,38.73 136.84,38.1 136.84,34.61 126.36,24.13 114.62,24.13 102.23,11.75 IC9.12
CS_4  (via drill 0.9 pad 1.68)
  Bottom 0.406: IC9.11 100.97,9.21 114.94,23.18 127.32,23.18 v139.06,34.92
CS_5  (via drill 0.9 pad 1.68)
  Bottom 0.406: v139.06,37.47 140.34,36.2 140.34,33.97 128.59,22.23 115.25,22.23 99.69,6.67 IC9.10
CS_6  (via drill 0.9 pad 1.68)
  Bottom 0.406: IC9.9 98.42,4.13 115.57,21.27 129.86,21.27 141.6,33.02 v141.6,34.92
CS_373  (via drill 0.6 pad 1.42)
  Top 0.406: v68.26,102.55 v68.26,18.73
  Bottom 0.406: IC9.7 89.85,6.67 90.81,7.62 90.81,14.92 90.17,15.56 74.61,15.56 71.44,18.73 v68.26,18.73
  Bottom 0.61: IC10.1 IC10.2 v68.26,102.55
CS_BANKED_RAM  (via drill 0.6 pad 1.42)
  Top 0.406: v69.53,65.41 v69.53,16.83
  Bottom 0.406: IC6.12 65.41,11.43 69.53,15.56 v69.53,16.83 | U$2.20 64.77,66.67 66.04,65.41 v69.53,65.41
CS_EPROM  (via drill 0.6 pad 1.42)
  Top 0.406: v72.39,15.56 v72.39,65.41
  Bottom 0.406: U$3.20 81.92,66.67 80.64,65.41 v72.39,65.41 | IC6.5 56.83,11.43 58.1,10.16 65.41,10.16 70.8,15.56 v72.39,15.56
CS_RAM32K  (via drill 0.6 pad 1.42)
  Top 0.406: v46.67,13.97 v46.67,65.41
  Bottom 0.406: IC1.4 v46.67,13.97 | v46.67,65.41 45.72,65.41 44.45,66.67 U$4.20
D0  (via drill 0.6 pad 1.42)
  Top 0.406: v73.03,83.82 v73.03,71.75 | v107.31,74.3 v107.31,83.19
  Bottom 0.406: IC8.33 25.4,87 22.86,84.45 22.86,76.2 26.04,73.03 44.45,73.03 45.72,71.75 U$4.11 60.33,71.75 61.59,73.03 64.77,73.03 66.04,71.75 v73.03,71.75 U$2.11 80.64,71.75 81.92,73.03 85.72,73.03 87,71.75 U$3.11 104.78,71.75 v107.31,74.3 | IC2.3 81.92,86.36 80.64,85.09 74.3,85.09 v73.03,83.82 | v107.31,83.19 SV1.5
D1  (via drill 0.6 pad 1.42)
  Top 0.406: v89.53,79.38 v89.53,74.3 | v105.41,76.2 v105.41,81.92
  Bottom 0.406: IC8.32 25.4,84.45 23.81,82.87 23.81,77.47 25.72,75.56 44.45,75.56 45.72,74.3 U$4.12 60.33,74.3 61.59,75.56 64.77,75.56 66.04,74.3 U$2.12 80.64,74.3 81.92,75.56 85.72,75.56 87,74.3 v89.53,74.3 U$3.12 103.5,74.3 v105.41,76.2 | IC2.4 84.45,89.53 85.09,90.17 87.63,90.17 88.27,89.53 88.27,87 89.53,85.72 v89.53,79.38 | v105.41,81.92 140.34,81.92 SV1.6
D2  (via drill 0.6 pad 1.42)
  Top 0.406: v92.08,79.38 v92.08,76.83 | v102.23,76.83 v102.23,80.64
  Bottom 0.406: IC8.31 25.4,81.92 24.77,81.28 24.77,78.74 25.4,78.11 44.45,78.11 45.72,76.83 U$4.13 60.33,76.83 61.59,78.11 64.77,78.11 66.04,76.83 U$2.13 80.64,76.83 81.92,78.11 85.72,78.11 87,76.83 v92.08,76.83 U$3.13 v102.23,76.83 | IC2.7 v92.08,79.38 | v102.23,80.64 SV1.7
D3
  Bottom 0.406: IC8.30 U$4.15 44.45,79.38 45.72,78.11 60.33,78.11 61.59,79.38 U$2.15 64.77,79.38 66.04,78.11 80.64,78.11 81.92,79.38 U$3.15 85.72,79.38 87,78.11 94.61,78.11 | 94.61,78.11 103.5,78.11 104.78,79.38 140.34,79.38 SV1.8 | IC2.8 94.61,78.11
D4  (via drill 0.6 pad 1.42)
  Top 0.406: v95.89,79.38 v95.89,75.56
  Bottom 0.406: IC8.29 U$4.16 44.45,76.83 45.72,75.56 60.33,75.56 61.59,76.83 U$2.16 64.77,76.83 66.04,75.56 80.64,75.56 81.92,76.83 U$3.16 85.72,76.83 87,75.56 v95.89,75.56 102.87,75.56 105.41,78.11 SV1.9 | IC2.13 94.61,90.81 95.89,89.53 v95.89,79.38
D5  (via drill 0.6 pad 1.42)
  Top 0.406: v93.34,81.28 v93.34,73.03
  Bottom 0.406: IC8.28 U$4.17 44.45,74.3 45.72,73.03 60.33,73.03 61.59,74.3 U$2.17 64.77,74.3 66.04,73.03 80.64,73.03 81.92,74.3 U$3.17 85.72,74.3 87,73.03 v93.34,73.03 104.14,73.03 107.95,76.83 140.34,76.83 SV1.10 | IC2.14 92.08,90.81 93.34,89.53 v93.34,81.28
D6  (via drill 0.6 pad 1.42)
  Top 0.406: v90.81,81.28 v90.81,70.48
  Bottom 0.406: IC8.27 U$4.18 44.45,71.75 45.72,70.48 60.33,70.48 61.59,71.75 U$2.18 64.77,71.75 66.04,70.48 80.64,70.48 81.92,71.75 U$3.18 85.72,71.75 87,70.48 v90.81,70.48 105.41,70.48 110.49,75.56 SV1.11 | IC2.17 84.45,94.3 85.72,93.03 89.53,93.03 90.81,91.76 v90.81,81.28
D7  (via drill 0.6 pad 1.42)
  Top 0.406: v74.93,83.82 v74.93,67.94
  Bottom 0.406: IC8.26 U$4.19 44.45,69.22 45.72,67.94 60.33,67.94 61.59,69.22 U$2.19 64.77,69.22 66.04,67.94 v74.93,67.94 80.64,67.94 81.92,69.22 U$3.19 85.72,69.22 87,67.94 104.46,67.94 110.81,74.3 140.34,74.3 SV1.12 | IC2.18 81.92,90.81 83.19,89.53 83.19,86.04 80.96,83.82 v74.93,83.82
FI2  (via drill 0.6 pad 1.42)
  Top 0.406: v22.23,29.21 v22.23,97.16
  Bottom 0.406: IC5.9 35.56,8.89 33.02,11.43 IC5.5 22.86,11.43 19.68,14.61 19.68,26.67 v22.23,29.21 125.09,29.21 132.08,36.2 132.08,40.32 136.84,45.09 SV1.35
  Bottom 0.61: v22.23,97.16 IC8.37
GND  (via drill 0.6 pad 1.42)
  Top 0.61: v54.61,104.78 v54.61,109.86 | v74.3,109.86 v74.3,104.78 | v110.49,97.79 v110.49,89.53 | v123.83,85.72 v123.83,71.75 | v14.61,19.68 v23.18,19.68 | v30.48,56.52 v30.48,81.92
  Bottom 0.61: IC8.21 v30.48,56.52
  Bottom 1.016: 83.72,40.41 C3.2 83.8,40.38
  Bottom 1.27: 99.06,86.36 U$3.14
  pour Bottom (isolate 0.61, no thermals): 0,117.47 0,0 151.13,0 151.13,117.47
IRQ  (via drill 0.6 pad 1.42)
  Top 0.406: v15.88,97.16 v15.88,36.2
  Bottom 0.406: SV1.30 140.34,51.44 136.84,51.44 127.32,41.91 127.32,37.78 124.78,35.24 16.83,35.24 v15.88,36.2
  Bottom 0.61: IC8.4 v15.88,97.16
  Bottom 0.813: v15.88,97.16 R4.1
N$1
  Bottom 0.406: IC1.5 47.31,11.43 48.26,12.38 48.26,19.68 48.9,20.32 52.7,20.32 53.98,21.59 IC6.1
N$2  (via drill 0.9 pad 1.68)
  other vias: 141.6,37.47
N$3
  Bottom 0.61: IC2.19 R7.1
N$4
  Bottom 0.61: R7.2 LED1.K
N$5
  Bottom 0.61: IC8.3 R2.1
N$6
  Bottom 0.61: IC8.2 R5.1
N$7
  Bottom 0.813: R10.1 QG1.1
N$11  (via drill 0.6 pad 1.42)
  Top 0.406: v93.34,92.08 v80.33,92.08
  Bottom 0.406: IC2.11 99.69,97.16 98.74,98.11 93.98,98.11 93.34,97.47 v93.34,92.08 | v80.33,92.08 74.3,92.08 72.07,89.85 IC10.8
N$12
  Bottom 0.61: IC10.9 IC10.10 IC10.11
N$13
  Bottom 0.61: IC10.3 68.26,100.01 70.8,102.55 IC10.13
N$14
  Bottom 0.61: IC10.6 67.31,92.39 68.9,93.98 68.9,98.42 70.48,100.01 IC10.12
N$15
  Bottom 0.406: IC2.6 89.53,90.17 88.27,91.44 85.09,91.44 83.19,93.34 R8.1
N$17
  Bottom 0.61: LED2.K 84.45,104.78 83.19,103.5 R8.2
N$18
  Bottom 0.406: IC5.10 35.56,11.43 30.48,16.51 IC5.3
N$19
  Bottom 0.406: IC6.4 58.1,13.97 59.37,12.7 65.09,12.7 66.04,13.65 66.04,18.1 65.09,19.05 IC6.15
N$20
  Bottom 0.61: IC9.6 84.77,9.21 R9.1
N$21
  Bottom 0.406: IC6.11 65.41,8.89 70.8,14.29 IC9.4
N$23  (via drill 0.6 pad 1.27)
  other vias: 5,112.31
N$24  (via drill 0.6 pad 1.27)
  other vias: 145.97,5
N$25  (via drill 0.6 pad 1.27)
  other vias: 145.97,112.31
N$37  (via drill 0.6 pad 1.27)
  other vias: 5,5
NMI  (via drill 0.6 pad 1.42)
  Top 0.406: v14.61,92.08 v14.61,34.29
  Bottom 0.406: SV1.31 136.84,50.16 128.27,41.59 128.27,37.47 125.09,34.29 v14.61,34.29
  Bottom 0.61: IC8.6 v14.61,92.08 R3.1
OUT_1
  Bottom 0.406: IC2.16 87,96.52 90.49,100.01 102.55,100.01 107,95.57 123.19,95.57 130.49,88.27 SV1.1
OUT_2
  Bottom 0.406: IC2.15 89.53,97.16 91.44,99.06 101.92,99.06 106.68,94.3 122.87,94.3 130.18,87 140.34,87 SV1.2
OUT_3
  Bottom 0.406: SV1.3 129.86,85.72 122.56,93.03 98.74,93.03 97.16,94.61 IC2.12
OUT_4
  Bottom 0.406: 97.16,88.9 IC2.9 97.16,90.17 98.74,91.76 122.24,91.76 129.54,84.45 140.34,84.45 SV1.4
RD  (via drill 0.6 pad 1.42)
  Top 0.406: v49.85,31.75 v49.85,60.33
  Bottom 0.406: U$4.22 44.45,61.59 45.72,60.33 v49.85,60.33 60.33,60.33 61.59,61.59 U$2.22 64.77,61.59 66.04,60.33 80.64,60.33 81.92,61.59 U$3.22 | IC5.6 21.27,8.89 16.83,13.34 16.83,27.94 20.64,31.75 v49.85,31.75 125.09,31.75 130.18,36.83 130.18,40.96 136.84,47.62 SV1.33
RST  (via drill 0.6 pad 1.42)
  Top 0.406: v24.77,104.78 v24.77,37.47
  Bottom 0.406: SV1.29 136.84,52.7 126.36,42.23 126.36,38.1 124.46,36.2 26.04,36.2 v24.77,37.47
  Bottom 0.61: R1.1 v24.77,104.78 IC8.40 IC7.1 PAD2.1
RW  (via drill 0.6 pad 1.42)
  Top 0.406: v23.5,89.53 v23.5,27.94
  Bottom 0.406: 30.8,13.97 IC5.4 27.26,13.97 | SV1.36 140.34,43.81 136.84,43.81 133.03,40.01 133.03,35.88 125.09,27.94 v23.5,27.94 20.95,25.4 20.95,15.56 22.54,13.97 27.26,13.97 | IC8.34 v23.5,89.53 | 27.26,13.97 27.26,18.37 27.94,19.05 IC5.2
  Bottom 0.61: IC5.1 IC5.2
VCC  (via drill 0.6 pad 1.42, 0.6 pad 1.78)
  Top 0.61: v27.3,43.18 v27.3,24.13 | v117.47,71.12 v117.47,107.31 | v19.52,87 v19.52,43.18
  Bottom 0.406: C12.1 | C11.1 37.15,24.13 | C13.1 | C14.1 117.48,55.24 117.47,55.24 | C7.1 | C16.+ 19.68,107.31 | R10.2
  Bottom 0.61: 117.47,69.22 v117.47,71.12 C5.1 | 117.47,69.22 117.47,55.24 117.47,52.7 IC4.20 | C15.+ | IC3.20 117.47,69.22 | R4.2 19.52,97.16
  Bottom 0.813: C4.1 QG1.14 | R3.2 IC8.35 C8.1
  Bottom 1.016: 83.8,43.18 C3.1 | R9.2 84.14,24.13 | 84.14,24.13 C13.1 IC9.16 | 84.14,24.13 C12.1 | C12.1 C17.1 | C17.1 C11.1 IC5.14 | 37.15,24.13 v27.3,24.13 | IC1.16 C17.1 | IC6.16 C12.1
  Bottom 1.27: C1.1 C2.1 | U$2.28 C2.1 | U$4.28 C1.1 | U$3.28 C3.1 83.8,43.18 66.99,43.18 C2.1 | U$3.28 U$3.27 | U$3.1 U$3.28 | C6.1 | C6.1 | 51.44,107.31 R10.2 IC7.2 19.68,107.31 C16.+ R1.2 19.53,102.25 R5.2 R2.2 19.52,97.16 R3.2 v19.52,87 IC8.8 C6.1 | 51.44,107.31 QG1.14 | 51.44,107.31 71.12,107.31 | 71.12,107.31 76.83,107.31 | 76.83,107.31 C7.1 | 76.83,107.31 LED1.A C15.+ LED2.A C10.+ v117.47,107.31 125.09,107.31 132.72,99.69 JP3.2 | C2.1 | IC10.14 C9.1 71.13,107.33 71.12,107.31 | C7.1 IC2.20 | v19.52,43.18 v27.3,43.18 C1.1
VMA  (via drill 0.6 pad 1.42)
  Top 0.406: v17.14,94.61 v17.14,33.02 | v40.01,19.05 v40.01,33.02
  Bottom 0.406: SV1.32 140.34,48.9 136.84,48.9 129.22,41.27 129.22,37.15 125.09,33.02 v40.01,33.02 v17.14,33.02 | IC8.5 v17.14,94.61
  Bottom 0.61: v40.01,19.05 IC5.13 IC5.12
WR  (via drill 0.6 pad 1.42)
  Top 0.406: v51.12,30.48 v51.12,47.62 | v66.99,47.62 v66.99,94.93
  Bottom 0.406: U$4.27 44.45,48.9 45.72,47.62 v51.12,47.62 60.33,47.62 61.59,48.9 U$2.27 64.77,48.9 66.04,47.62 v66.99,47.62 | IC5.8 36.51,6.35 32.7,10.16 22.23,10.16 18.1,14.29 18.1,27.62 20.95,30.48 v51.12,30.48 125.09,30.48 131.13,36.51 131.13,40.64 136.84,46.35 140.34,46.35 SV1.34
  Bottom 0.61: v66.99,94.93 IC10.5 IC10.4

### Text on the board
Bottom: MC6802 / CPU BOARD